# Altium schematic sheet Buffer.SchDoc
size A4; SheetNumber: 8; SheetTotal: 10
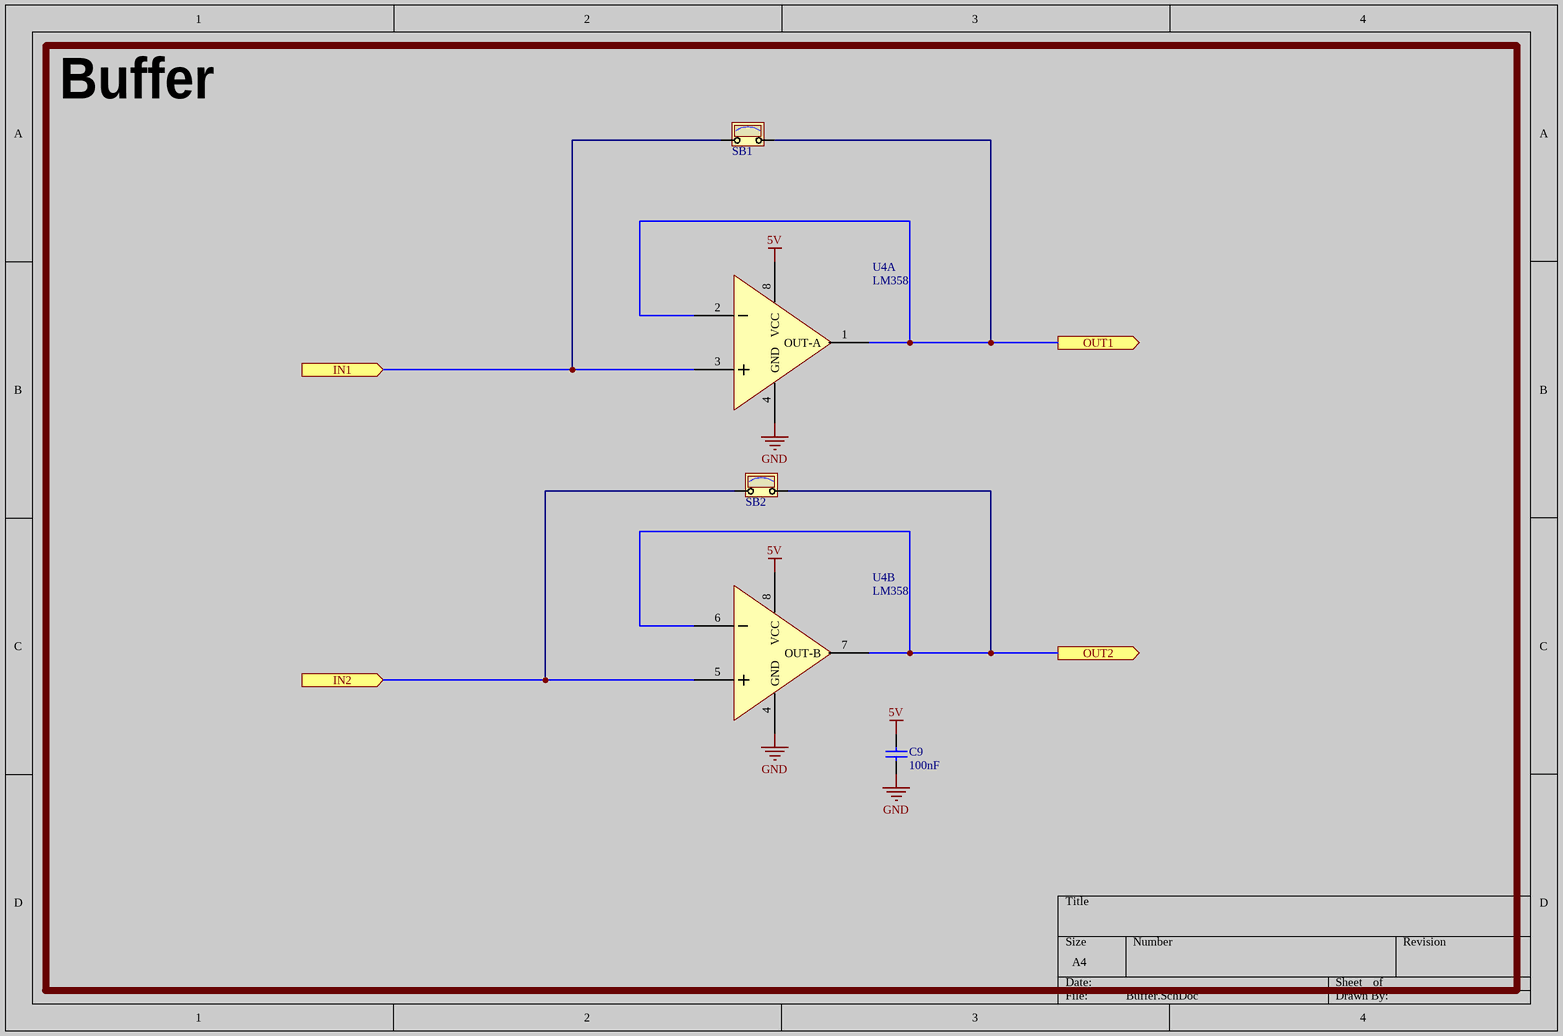
[diagram p0: Buffer.SchDoc]

## Parts
C9  100nF  [CAPC0603]
SB1  Solder Bridge ON  [RES 0R]  (value not drawn)
SB2  Solder Bridge ON  [RES 0R]  (value not drawn)
U4  LM358  [SOP8]  (parts A,B of 2)

## Ports
IN1 (in), IN2 (in), OUT1 (out), OUT2 (out)

## Nets
5V: C9.1 U4.8(VCC)
GND: C9.2 U4.4(GND)
IN1: SB1.1 U4.3(-) ; port IN1
IN2: SB2.1 U4.5(+) ; port IN2
OUT1: SB1.2 U4.1(OUT-A) U4.2(+) ; port OUT1
OUT2: SB2.2 U4.6(-) U4.7(OUT-B) ; port OUT2

## Notes on the sheet
- Buffer

## Library data of the parts
C9 = Cap: Capacitor; Published: 8-Jun-2000; LatestRevisionDate: 17-Jul-2002; LatestRevisionNote: Re-released for DXP Platform.; PackageReference: RAD-0.3; Publisher: Altium Limited; PackageDescription: Radial Cap, Thru-Hole; 2 Leads; 0.3 in Pin Spacing; Value: 100nF
SB1 SB2 = SB_ON: Solder: YES; Revision: July-2002: Re-released for DXP Platform.; ECCN_US/EU: n/a
U4 = LM358: Single Supply Dual Operational Amplifier